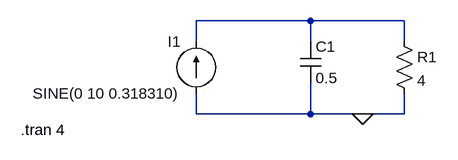
[diagram p0: schematic 19thoct(circuit3).asc]
19thoct(circuit3).asc, the LTspice schematic file:
Version 4
SHEET 1 880 680
WIRE 208 80 32 80
WIRE 352 80 208 80
WIRE 32 112 32 80
WIRE 208 112 208 80
WIRE 352 112 352 80
WIRE 32 224 32 192
WIRE 208 224 208 176
WIRE 208 224 32 224
WIRE 288 224 208 224
WIRE 352 224 352 192
WIRE 352 224 288 224
FLAG 288 224 0
SYMBOL current 32 192 R180
WINDOW 0 24 80 Left 2
WINDOW 3 24 0 Left 2
WINDOW 123 0 0 Left 0
WINDOW 39 0 0 Left 0
SYMATTR InstName I1
SYMATTR Value SINE(0 10 0.318310)
SYMBOL cap 192 112 R0
SYMATTR InstName C1
SYMATTR Value 0.5
SYMBOL res 336 96 R0
SYMATTR InstName R1
SYMATTR Value 4
TEXT -238 248 Left 2 !.tran 4

The netlist it stands for:
* 19thoct(circuit3).asc
I1 0 N001 SINE(0 10 0.318310)
C1 N001 0 0.5
R1 N001 0 4
.tran 4
.backanno
.end